# EAGLE schematic Heating_Datalogger (EAGLE 8.2.2)
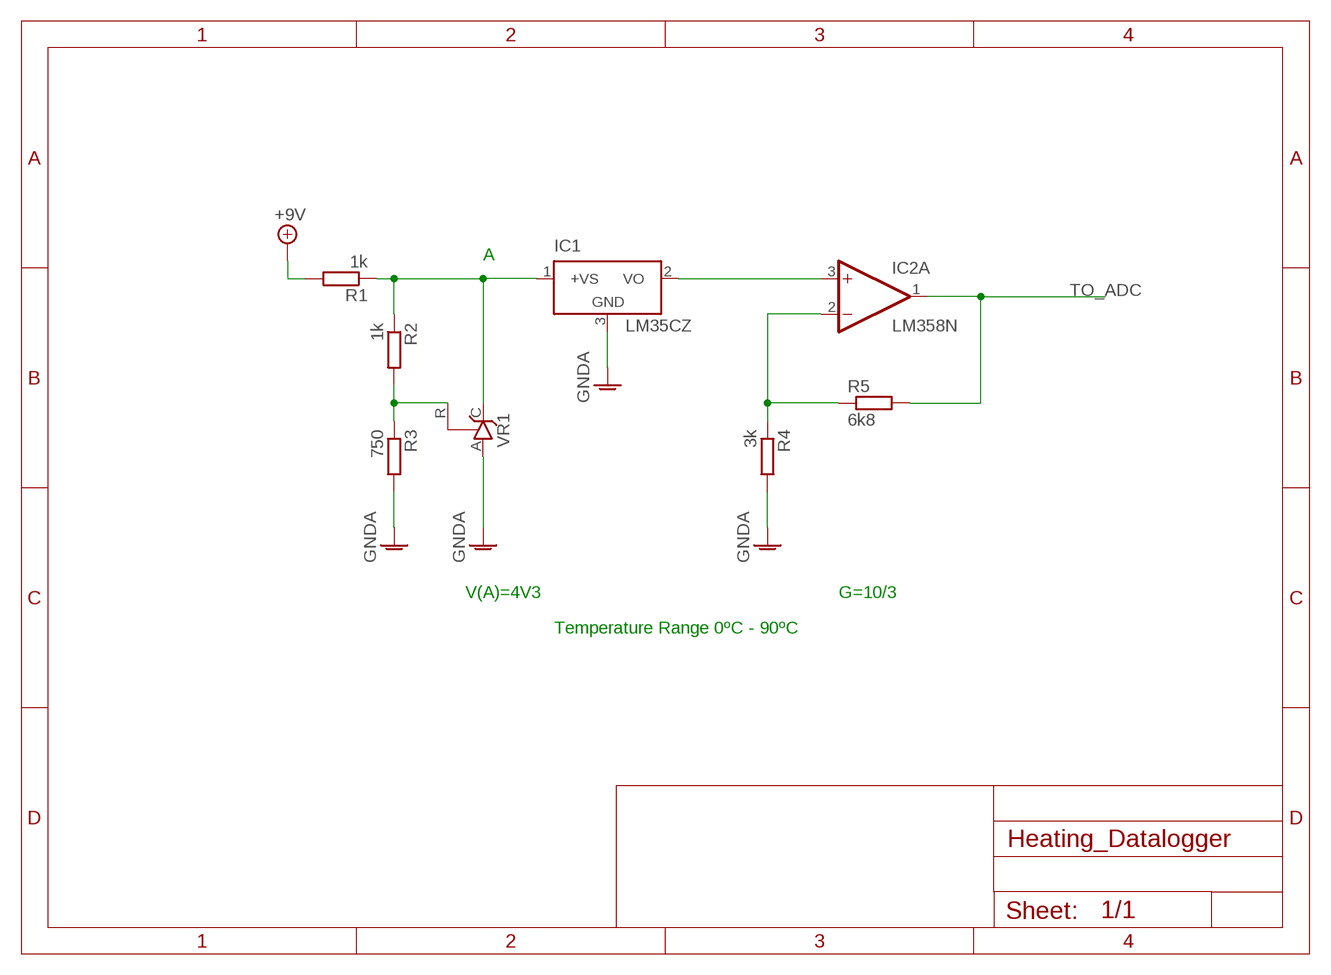
[diagram p0: schematic, sheet 1]

## Parts
IC1  LM35CZ  [TO92]
IC2  LM358N  [DIL08]
R1  1k  R-EU_0204/5  [0204/5]
R2  1k  R-EU_0204/5  [0204/5]
R3  750  R-EU_0204/5  [0204/5]
R4  3k  R-EU_0204/5  [0204/5]
R5  6k8  R-EU_0204/5  [0204/5]
VR1  TL431CLP  [TO92-CLP]

## Nets
+9V: R1.2
GNDA: IC1.3(GND) R3.2 R4.2 VR1.A
N$1: IC1.1(+VS) R1.1 R2.1 VR1.C
N$2: R2.2 R3.1 VR1.R
N$4: IC1.2(VO) IC2.3(A:+IN)
N$5: IC2.2(A:-IN) R4.1 R5.1
TO_ADC: IC2.1(A:OUT) R5.2
Unconnected: IC2.5(B:+IN) IC2.6(B:-IN) IC2.7(B:OUT)

## Notes on the sheet
- A
- V(A)=4V3 | G=10/3
- Temperature Range 0ºC - 90ºC

## Power pins joined to a net without a drawn wire
V+: IC2.8(P:V+)
V-: IC2.4(P:V-)

## Library data of the parts
IC1 = lm35:LM35: Single-Supply Centigrade Temperature Sensor Vout = (10mV/°C x Temp °C) +5mmmV Source: http://www.national.com/ds/LM/LM35.pdf
IC2 = linear:LM358: OP AMP also LM158; LM258; LM2904 Source: http://cache.national.com/ds/LM/LM158.pdf
R1-R5 = resistor:R-EU_: RESISTOR, European symbol
VR1 = v-reg:TL431CLP: VOLTAGE REGULATOR